# Altium schematic sheet Power.SchDoc
size A4
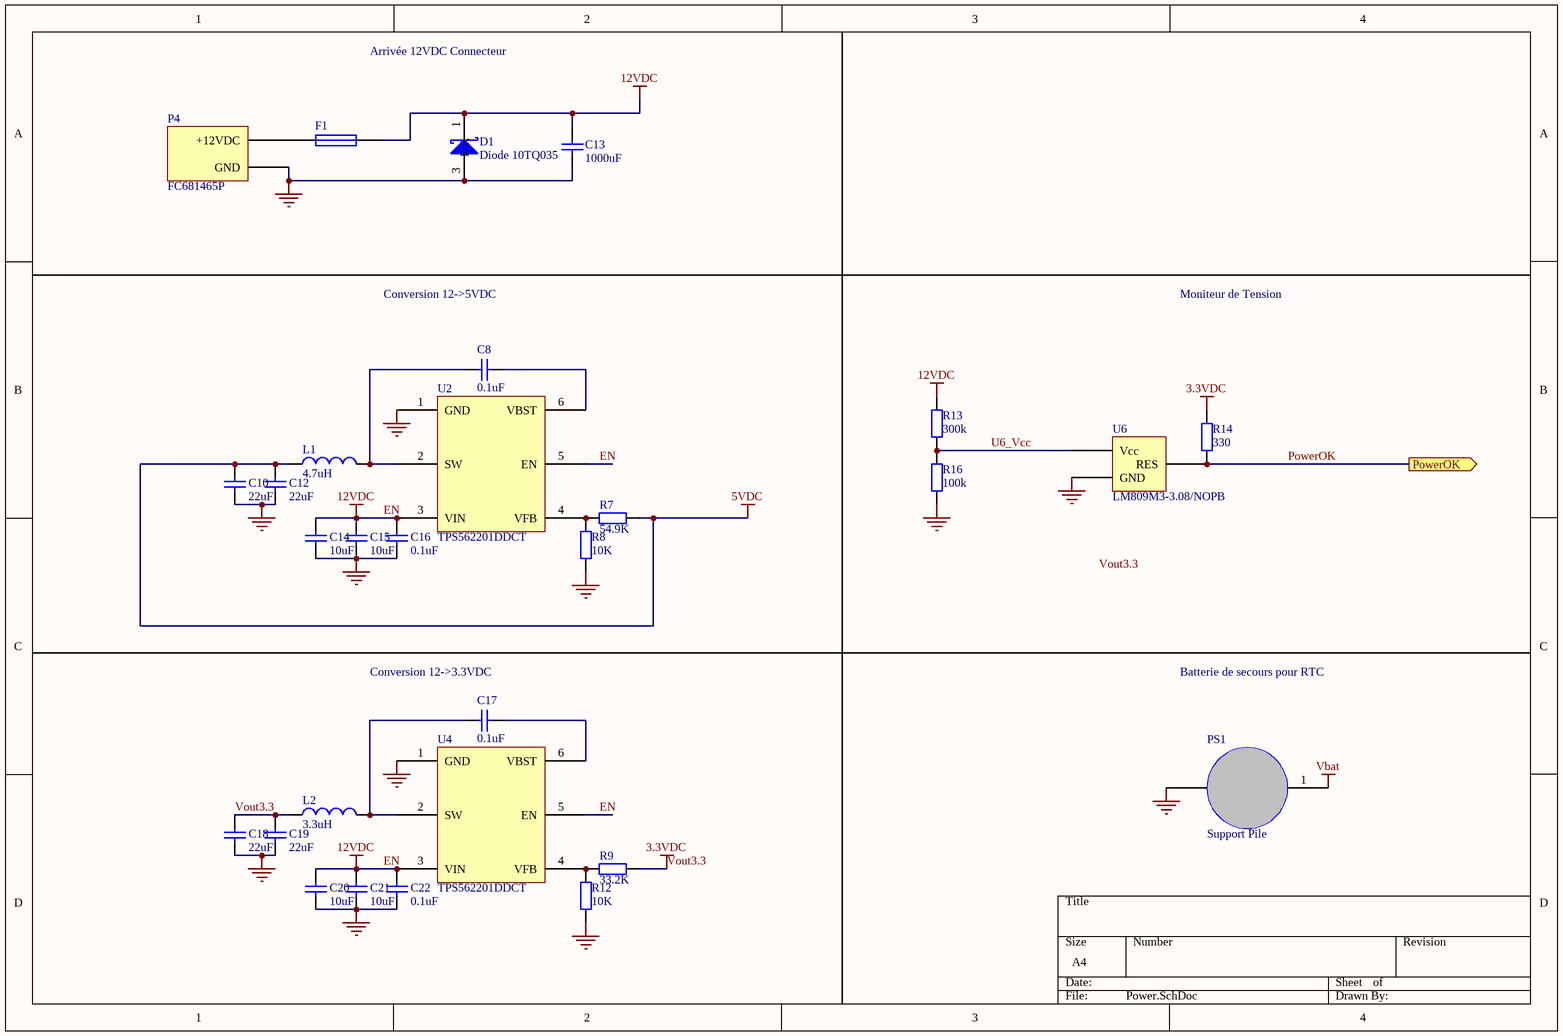
[diagram p0: Power.SchDoc]

## Parts
C8  0.1uF  [0603]
C10  22uF  [0603]
C12  22uF  [0603]
C13  1000uF  [Condo_trav]
C14  10uF  [0603]
C15  10uF  [0603]
C16  0.1uF  [0603]
C17  0.1uF  [0603]
C18  22uF  [0603]
C19  22uF  [0603]
C20  10uF  [0603]
C21  10uF  [0603]
C22  0.1uF  [0603]
D1  Diode 10TQ035  [DiodeZin]
F1  Fuse 1  [FUSIBLE]  (value not drawn)
L1  4.7uH  [Bobine Traversante 4.7]
L2  3.3uH  [Bobine Traversante 4.7]
P4  FC681465P  [JackAlim]
PS1  Support Pile  [Pile]
R7  54.9K  [0603]
R8  10K  [0603]
R9  33.2K  [0603]
R12  10K  [0603]
R13  300k  [0603]
R14  330  [0603]
R16  100k  [0603]
U2  TPS562201DDCT  [TPS562201DDCT]
U4  TPS562201DDCT  [TPS562201DDCT]
U6  LM809M3-3.08/NOPB  [LM809]

## Ports
PowerOK (out)

## Nets
5VDC: C10.1 C12.1 L1.1 R7.1
EN: C13.2 C14.1 C15.1 C16.1 C20.1 C21.1 C22.1 D1.1(K) F1.2 R13.2 U2.3(VIN) U2.5(EN) U4.3(VIN) U4.5(EN)  [also labelled 12VDC]
GND: C10.2 C12.2 C13.1 C14.2 C15.2 C16.2 C18.2 C19.2 C20.2 C21.2 C22.2 D1.3(A) P4.3(GND) PS1.2(-) R8.1 R12.1 R16.1 U2.1(GND) U4.1(GND) U6.1(GND)
Vbat: PS1.1(+)
Vout3.3: C18.1 C19.1 L2.1 R9.1 R14.2  [also labelled 3.3VDC]
PowerOK: R14.1 U6.2(RES) ; port PowerOK
U6_Vcc: R13.1 R16.2 U6.3(Vcc)
NetC8_1: C8.1 L1.2 U2.2(SW)
NetC8_2: C8.2 U2.6(VBST)
NetC17_1: C17.1 L2.2 U4.2(SW)
NetC17_2: C17.2 U4.6(VBST)
NetF1_1: F1.1 P4.1(+12VDC)
NetR7_2: R7.2 R8.2 U2.4(VFB)
NetR9_2: R9.2 R12.2 U4.4(VFB)

Not connected (* = marked no-connect by the designer): P4 2(GND)

## Notes on the sheet
- Arrivée 12VDC Connecteur
- Conversion 12->5VDC
- Moniteur de Tension
- (near C17) Conversion 12->3.3VDC
- Batterie de secours pour RTC
- Labels drawn without touching a wire or pin: Vout3.3

## Library data of the parts
C8 C10 C12 C14-C22 = Cap: Reg_5v; Fournisseur: CAHIER; Fabricant: CAHIER; Ref.Fabricant: CAHIER; Ref.Fournisseur: CAHIER
  C8 C16 C17 C22: Value: 0.1uF
  C10 C12 C18 C19: Value: 22uF
  C14 C15 C20 C21: Value: 10uF
C13 = Cap: Capacitor; Ref.Fournisseur: 1902972; Fournisseur: Farnell; Fabricant: Multicomp; Ref.Fabricant: MCGLR16V108M10X16
D1 = Diode 10TQ035: Diode Zenner; Fournisseur: Farnell; Ref.Fournisseur: 2453991; Fabricant: ON SEMICONDUCTOR; Ref.Fabricant: MM3Z15VB
F1 = Fuse 1: Fuse; Fournisseur: Farnell; Ref.Fournisseur: 1596504; Fabricant: Littelfuse; Ref.Fabricant: 39515000000
L1 = Inductor: L_Reg_5v; Fabricant: BOURNS; Ref.Fabricant: RLB0914-4R7ML; Fournisseur: Farnell; Ref.Fournisseur: 2309248; Value: 4.7uH
L2 = Inductor: L_Reg_3v; Fabricant: BOURNS; Ref.Fabricant: RLB0912-3R3ML; Fournisseur: Farnell; Ref.Fournisseur: 2309234; Value: 3.3uH
P4 = FC68148S: Power connector; Fournisseur: Farnell; Ref.Fournisseur: 1854512; Fabricant: CLIFF; Ref.Fabricant: FC681465P
PS1 = SMTU-1225-1-LF: Fournisseur: Farnell; Fabricant: Renata; Ref.Fournisseur: 1216353; Ref.Fabricant: SMTU-1225-1-LF
R7 = Res2: Resistor; Fournisseur: Farnell; Fabricant: TE CONNECTIVITY; Ref.Fabricant: CPF0402B54K9E1; Ref.Fournisseur: 2330744; Value: 54.9k
R8 R12 = Res2: Resistor; Fournisseur: Farnell; Fabricant: TE CONNECTIVITY; Ref.Fabricant: CPF0201D10KC1; Ref.Fournisseur: 2117887; Value: 10k
R9 = Res2: Resistor; Fournisseur: Cahier; Value: 33.2k; Fabricant: Cahier; Ref.Fabricant: Cahier; Ref.Fournisseur: Cahier
R13 = Res2: Resistor; Fournisseur: Farnell; Ref.Fournisseur: 2074433; Fabricant: MULTICOMP; Ref.Fabricant: MCSR08X3003FTL; Value: 300k
R14 = Res2: Resistor; Fabricant: TE Connectivity; Fournisseur: Farnell; Ref.Fabricant: RN73C1J232RBTDF; Ref.Fournisseur: 2687973
R16 = Res2: Resistor; Fournisseur: Farnell; Ref.Fournisseur: 2447226; Fabricant: MULTICOMP; Ref.Fabricant: MCWR06X1003FTL; Value: 100k
U2 U4 = TPS562201DDCT: Reg 12V-5V; Ref.Fournisseur: 2527034; Fournisseur: Farnell; Ref.Fabricant: Texas Instrument; Fabricant: TPS562201DDCT
U6 = LM809M3-3.08/NOPB: Voltage Monitor; Fournisseur: Farnell; Ref.Fournisseur: 2352609; Fabricant: TEXAS INSTRUMENTS; Ref.Fabricant: LM809M3-3.08/NOPB